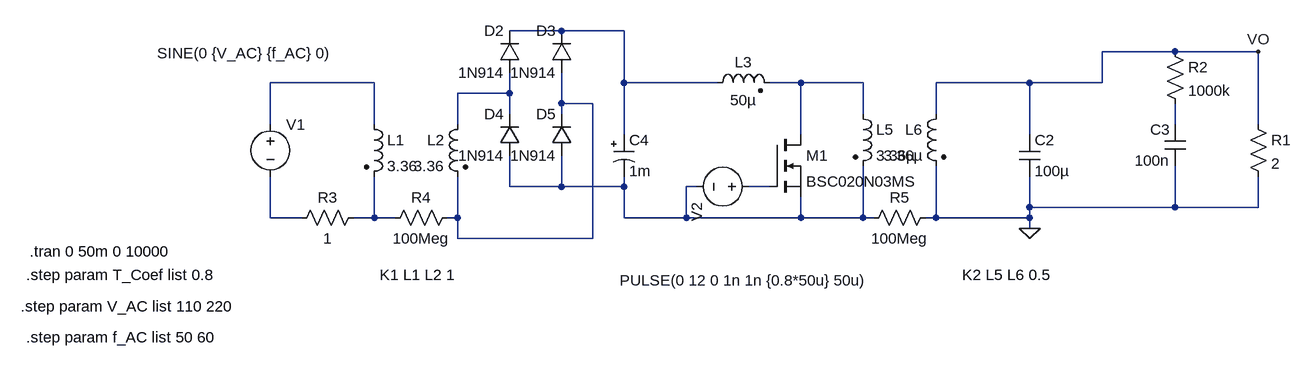
[diagram p0: schematic reference_boost_OBC.asc]
reference_boost_OBC.asc, the LTspice schematic file:
Version 4
SHEET 1 1480 680
WIRE -144 -32 -224 -32
WIRE -48 -32 -144 -32
WIRE 800 0 688 0
WIRE 928 0 800 0
WIRE -432 48 -592 48
WIRE -48 48 -48 -32
WIRE 96 48 -48 48
WIRE 224 48 176 48
WIRE 320 48 224 48
WIRE 576 48 432 48
WIRE 688 48 688 0
WIRE 688 48 576 48
WIRE -224 64 -224 32
WIRE -224 64 -304 64
WIRE -144 80 -144 32
WIRE -96 80 -144 80
WIRE -224 96 -224 64
WIRE -144 96 -144 80
WIRE 320 96 320 48
WIRE 432 96 432 48
WIRE -592 112 -592 48
WIRE -432 112 -432 48
WIRE -304 112 -304 64
WIRE 800 112 800 80
WIRE 928 112 928 0
WIRE -48 128 -48 48
WIRE 224 128 224 48
WIRE 576 128 576 48
WIRE -224 208 -224 160
WIRE -144 208 -144 160
WIRE -144 208 -224 208
WIRE -48 208 -48 192
WIRE -48 208 -144 208
WIRE 64 208 48 208
WIRE 176 208 144 208
WIRE 576 240 576 192
WIRE 800 240 800 176
WIRE 800 240 576 240
WIRE 928 240 928 192
WIRE 928 240 800 240
WIRE -592 256 -592 192
WIRE -544 256 -592 256
WIRE -432 256 -432 192
WIRE -432 256 -464 256
WIRE -400 256 -432 256
WIRE -304 256 -304 192
WIRE -304 256 -320 256
WIRE -48 256 -48 208
WIRE 48 256 48 208
WIRE 48 256 -48 256
WIRE 224 256 224 224
WIRE 224 256 48 256
WIRE 320 256 320 176
WIRE 320 256 224 256
WIRE 336 256 320 256
WIRE 432 256 432 176
WIRE 432 256 416 256
WIRE 576 256 576 240
WIRE 576 256 432 256
WIRE 576 272 576 256
WIRE -304 288 -304 256
WIRE -96 288 -96 80
WIRE -96 288 -304 288
FLAG 576 272 0
FLAG 928 0 VO
SYMBOL voltage -592 96 R0
WINDOW 123 0 0 Left 0
WINDOW 39 0 0 Left 0
WINDOW 3 -174 -94 Left 2
SYMATTR Value SINE(0 {V_AC} {f_AC} 0)
SYMATTR InstName V1
SYMBOL ind2 80 64 R270
WINDOW 0 32 56 VTop 2
WINDOW 3 5 56 VBottom 2
SYMATTR InstName L3
SYMATTR Value 50µ
SYMATTR Type ind
SYMBOL res 912 96 R0
SYMATTR InstName R1
SYMATTR Value 2
SYMBOL nmos 176 128 R0
SYMATTR InstName M1
SYMATTR Value BSC020N03MS
SYMBOL voltage 160 208 R90
WINDOW 0 24 96 Left 2
WINDOW 3 144 -169 VRight 2
WINDOW 123 0 0 Left 0
WINDOW 39 0 0 Left 0
SYMATTR InstName V2
SYMATTR Value PULSE(0 12 0 1n 1n {0.8*50u} 50u)
SYMBOL cap 560 128 R0
SYMATTR InstName C2
SYMATTR Value 100µ
SYMBOL cap 816 176 R180
WINDOW 0 24 56 Left 2
WINDOW 3 24 8 Left 2
SYMATTR InstName C3
SYMATTR Value 100n
SYMBOL res 784 -16 R0
SYMATTR InstName R2
SYMATTR Value 1000k
SYMBOL ind2 -448 96 R0
SYMATTR InstName L1
SYMATTR Value 3.36
SYMATTR Type ind
SYMBOL ind2 -288 96 M0
SYMATTR InstName L2
SYMATTR Value 3.36
SYMATTR Type ind
SYMBOL res -448 240 R90
WINDOW 0 0 56 VBottom 2
WINDOW 3 32 56 VTop 2
SYMATTR InstName R3
SYMATTR Value 1
SYMBOL diode -128 32 R180
WINDOW 0 24 64 Left 2
WINDOW 3 24 0 Left 2
SYMATTR InstName D3
SYMATTR Value 1N914
SYMBOL polcap -64 128 R0
SYMATTR InstName C4
SYMATTR Value 1m
SYMBOL res -304 240 R90
WINDOW 0 0 56 VBottom 2
WINDOW 3 32 56 VTop 2
SYMATTR InstName R4
SYMATTR Value 100Meg
SYMBOL diode -208 32 R180
WINDOW 0 24 64 Left 2
WINDOW 3 24 0 Left 2
SYMATTR InstName D2
SYMATTR Value 1N914
SYMBOL diode -208 160 R180
WINDOW 0 24 64 Left 2
WINDOW 3 24 0 Left 2
SYMATTR InstName D4
SYMATTR Value 1N914
SYMBOL diode -128 160 R180
WINDOW 0 24 64 Left 2
WINDOW 3 24 0 Left 2
SYMATTR InstName D5
SYMATTR Value 1N914
SYMBOL ind2 304 80 R0
SYMATTR InstName L5
SYMATTR Value 3.36µ
SYMATTR Type ind
SYMBOL ind2 448 80 M0
SYMATTR InstName L6
SYMATTR Value 3.36µ
SYMATTR Type ind
SYMBOL res 432 240 R90
WINDOW 0 0 56 VBottom 2
WINDOW 3 32 56 VTop 2
SYMATTR InstName R5
SYMATTR Value 100Meg
TEXT -424 344 Left 2 !K1 L1 L2 1
TEXT -968 344 Left 2 !.step param T_Coef list 0.8
TEXT -976 392 Left 2 !.step param V_AC list 110 220
TEXT -968 440 Left 2 !.step param f_AC list 50 60
TEXT 472 344 Left 2 !K2 L5 L6 0.5
TEXT -962 308 Left 2 !.tran 0 50m 0 10000

The netlist it stands for:
* reference_boost_OBC.asc
V1 N002 N009 SINE(0 {V_AC} {f_AC} 0)
L3 N001 N003 50µ
R1 VO 0 2
M1 N003 N008 N007 N007 BSC020N03MS
V2 N008 N007 PULSE(0 12 0 1n 1n {0.8*50u} 50u)
C2 VO 0 100µ
C3 0 N006 100n
R2 VO N006 1000k
L1 N002 N010 3.36
L2 N004 N005 3.36
R3 N010 N009 1
D3 N005 N001 1N914
C4 N001 N007 1m
R4 N005 N010 100Meg
D2 N004 N001 1N914
D4 N007 N004 1N914
D5 N007 N005 1N914
L5 N003 N007 3.36µ
L6 VO 0 3.36µ
R5 0 N007 100Meg
.model D D
.lib standard.dio
.model NMOS NMOS
.model PMOS PMOS
.lib standard.mos
K1 L1 L2 1
.step param T_Coef list 0.8
.step param V_AC list 110 220
.step param f_AC list 50 60
K2 L5 L6 0.5
.tran 0 50m 0 10000
.backanno
.end